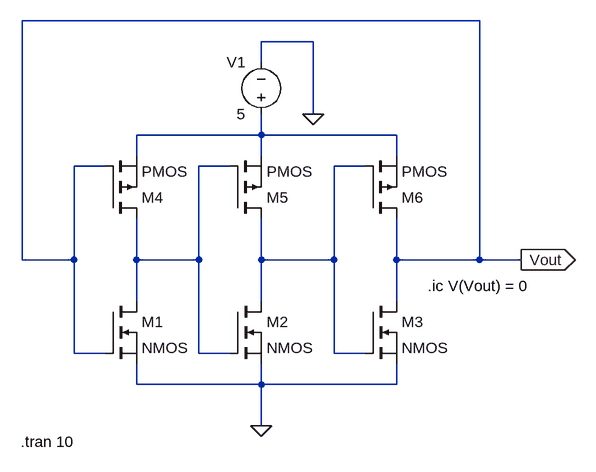
[diagram p0: schematic IdealRO.asc]
IdealRO.asc, the LTspice schematic file:
Version 4
SHEET 1 880 680
WIRE 608 -256 -96 -256
WIRE 352 -224 272 -224
WIRE 272 -192 272 -224
WIRE 352 -112 352 -224
WIRE 272 -80 272 -112
WIRE 272 -80 80 -80
WIRE 480 -80 272 -80
WIRE 80 -48 80 -80
WIRE 272 -48 272 -80
WIRE 480 -48 480 -80
WIRE 32 -32 -16 -32
WIRE 224 -32 176 -32
WIRE 432 -32 384 -32
WIRE -96 112 -96 -256
WIRE -16 112 -16 -32
WIRE -16 112 -96 112
WIRE 80 112 80 48
WIRE 176 112 176 -32
WIRE 176 112 80 112
WIRE 272 112 272 48
WIRE 384 112 384 -32
WIRE 384 112 272 112
WIRE 480 112 480 48
WIRE 608 112 608 -256
WIRE 608 112 480 112
WIRE 672 112 608 112
WIRE 80 176 80 112
WIRE 272 176 272 112
WIRE 480 176 480 112
WIRE -16 256 -16 112
WIRE 32 256 -16 256
WIRE 176 256 176 112
WIRE 224 256 176 256
WIRE 384 256 384 112
WIRE 432 256 384 256
WIRE 80 304 80 272
WIRE 272 304 272 272
WIRE 272 304 80 304
WIRE 480 304 480 272
WIRE 480 304 272 304
WIRE 272 368 272 304
FLAG 352 -112 0
FLAG 272 368 0
FLAG 672 112 Vout
IOPIN 672 112 Out
SYMBOL nmos 32 176 R0
SYMATTR InstName M1
SYMBOL nmos 224 176 R0
SYMATTR InstName M2
SYMBOL nmos 432 176 R0
SYMATTR InstName M3
SYMBOL pmos 32 48 M180
SYMATTR InstName M4
SYMBOL pmos 224 48 M180
SYMATTR InstName M5
SYMBOL pmos 432 48 M180
SYMATTR InstName M6
SYMBOL voltage 272 -96 R180
WINDOW 0 24 96 Left 2
WINDOW 3 24 16 Left 2
WINDOW 123 0 0 Left 0
WINDOW 39 0 0 Left 0
SYMATTR InstName V1
SYMATTR Value 5
TEXT 528 152 Left 2 !.ic V(Vout) = 0
TEXT -98 392 Left 2 !.tran 10

The netlist it stands for:
* IdealRO.asc
M1 N002 Vout 0 0 NMOS
M2 N003 N002 0 0 NMOS
M3 Vout N003 0 0 NMOS
M4 N002 Vout N001 N001 PMOS
M5 N003 N002 N001 N001 PMOS
M6 Vout N003 N001 N001 PMOS
V1 N001 0 5
.model NMOS NMOS
.model PMOS PMOS
.lib standard.mos
.ic V(Vout) = 0
.tran 10
.backanno
.end